# Altium schematic sheet OnboardMemoryTester.SchDoc
size C; Organization: Altium Limited; Address1: L3, 12a Rodborough Rd; Address2: Frenchs Forest; Address3: NSW; Address4: Australia 2086; DocumentNumber: 1; SheetNumber: 1; SheetTotal: 5
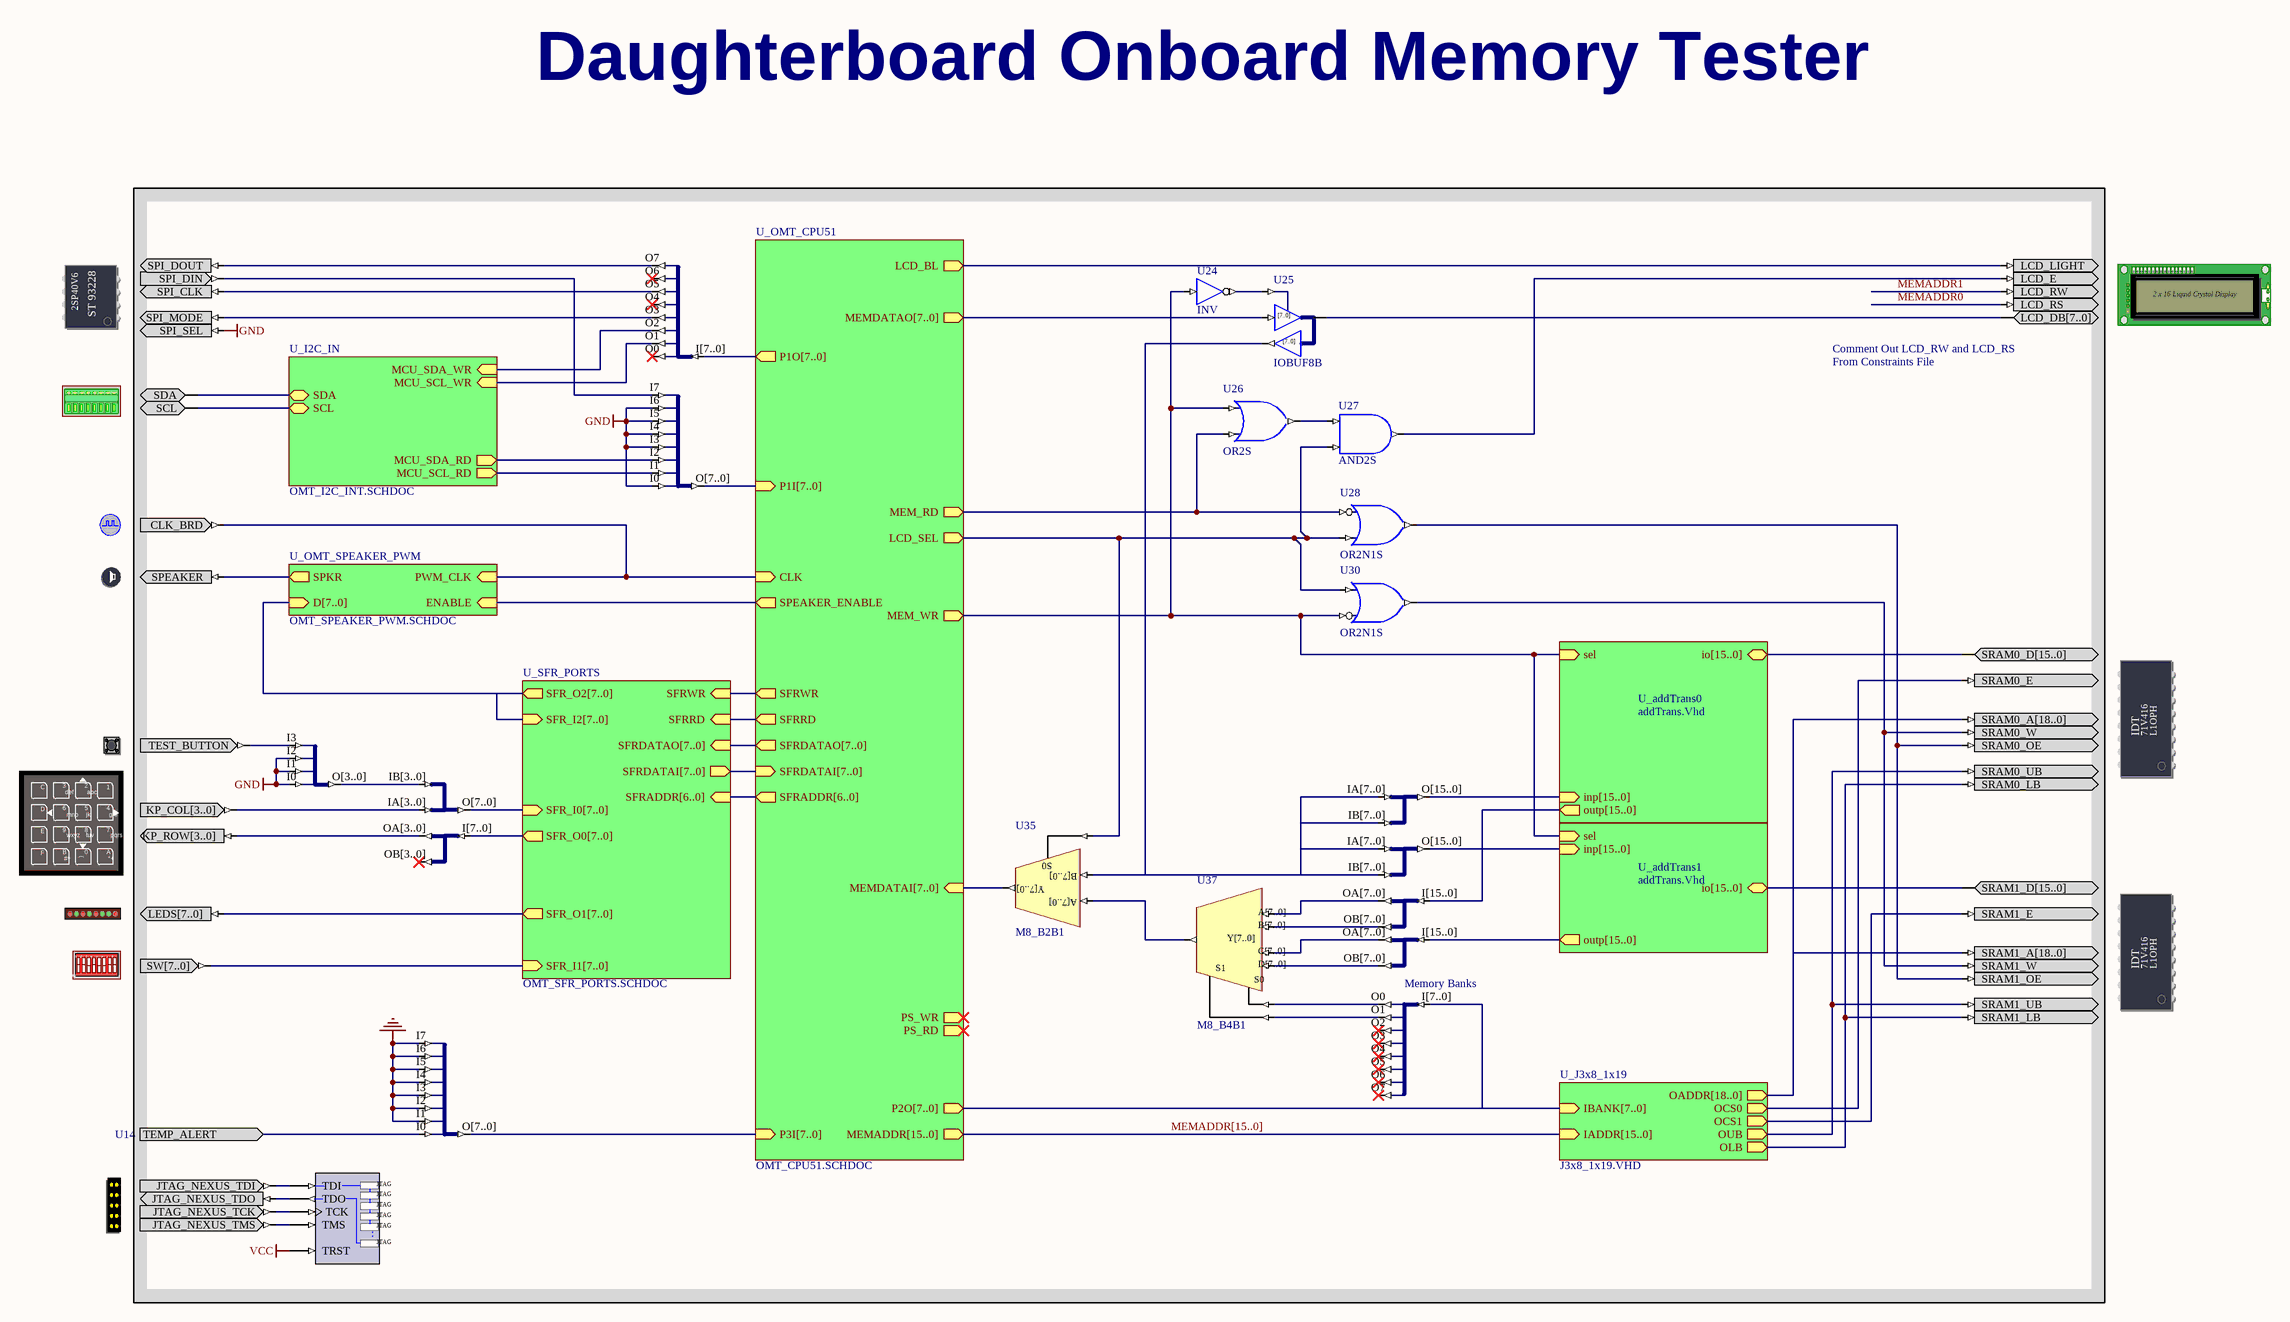
[diagram p0: OnboardMemoryTester.SchDoc]

## Parts
(Parts that share a designator on the sheet are numbered #1, #2 ... from top to bottom, then left to right.)
?#1  SERIALFMEMORY  (value not drawn)
?#2  ADCDAC_I2C  (value not drawn)
?#3  CLOCK_BOARD  (value not drawn)
?#4  SPEAKER  (value not drawn)
?#5  SRAM_DAUGHTER0  (value not drawn)
?#6  TEST_BUTTON  (value not drawn)
?#7  KEYPAD  (value not drawn)
?#8  SRAM_DAUGHTER1  (value not drawn)
?#9  LED  (value not drawn)
?#10  DIPSWITCH  (value not drawn)
?#11  NEXUS_JTAG_CONNECTOR  (value not drawn)
LCD  LCD  (value not drawn)
NEXUS_JTAG_PORT  NEXUS_JTAG_PORT  (value not drawn)
U23  J8B_8S  (value not drawn)
U24  INV
U25  IOBUF8B
U26  OR2S
U27  AND2S
U28  OR2N1S
U29  J8S_8B  (value not drawn)
U30  OR2N1S
U31  J4S_4B  (value not drawn)
U32  J4B2_8B  (value not drawn)
U33  J8B2_16B  (value not drawn)
U34  J8B_4B2  (value not drawn)
U35  M8_B2B1
U36  J8B2_16B  (value not drawn)
U37  M8_B4B1
U38  J16B_8B2  (value not drawn)
U39  J16B_8B2  (value not drawn)
U40  J8B_8S  (value not drawn)
U41  J8S_8B  (value not drawn)

## Sub-sheets
U_addTrans0 = addTrans.Vhd: inp[15..0] (in), io[15..0] (bidir), outp[15..0] (out), sel (in)  | VHDLENTITY: addTrans
U_addTrans1 = addTrans.Vhd: inp[15..0] (in), io[15..0] (bidir), outp[15..0] (out), sel (in)  | VHDLENTITY: addTrans
U_I2C_IN = OMT_I2C_INT.SCHDOC: SDA (bidir), SCL (bidir), MCU_SDA_RD (out), MCU_SDA_WR (in), MCU_SCL_WR (in), MCU_SCL_RD (out)
U_J3x8_1x19 = J3x8_1x19.VHD: IADDR[15..0] (in), IBANK[7..0] (in), OADDR[18..0] (out), OCS0 (out), OCS1 (out), OLB (out), OUB (out)  | VHDLENTITY: J3x8_1x19
U_OMT_CPU51 = OMT_CPU51.SCHDOC: CLK (in), MEMADDR[15..0] (out), MEM_WR (out), MEM_RD (out), SFRDATAO[7..0] (out), SFRDATAI[7..0] (in), SFRWR (out), SFRRD (out), SFRADDR[6..0] (out), LCD_BL (out), SPEAKER_ENABLE (out), P1O[7..0] (out), P1I[7..0] (in), MEMDATAO[7..0] (out), MEMDATAI[7..0] (in), PS_WR (out), PS_RD (out), P2O[7..0] (out), LCD_SEL (out), P3I[7..0] (in)
U_OMT_SPEAKER_PWM = OMT_SPEAKER_PWM.SCHDOC: ENABLE (in), PWM_CLK (in), D[7..0] (in), SPKR (out)
U_SFR_PORTS = OMT_SFR_PORTS.SCHDOC: SFRDATAO[7..0] (in), SFRWR (in), SFRDATAI[7..0] (out), SFRRD (in), SFRADDR[6..0] (in), SFR_I0[7..0] (in), SFR_O0[7..0] (out), SFR_I1[7..0] (in), SFR_O1[7..0] (out), SFR_I2[7..0] (in), SFR_O2[7..0] (out)

## Ports
TEMP_ALERT (in, see U14)

## Nets
GND: ?#1.SPI_SEL U29.I0 U29.I3 U29.I4 U29.I5 U29.I6 U31.I0 U31.I1 U31.I2 U41.I1 U41.I2 U41.I3 U41.I4 U41.I5 U41.I6 U41.I7
VCC: NEXUS_JTAG_PORT.TRST
MEMADDR0: LCD.LCD_RS
MEMADDR1: LCD.LCD_RW
TEMP_ALERT: U41.I0 ; port TEMP_ALERT
Net?#1_SPI_CLK: ?#1.SPI_CLK U23.O5
Net?#1_SPI_DIN: ?#1.SPI_DIN U29.I7
Net?#1_SPI_DOUT: ?#1.SPI_DOUT U23.O7
Net?#1_SPI_MODE: ?#1.SPI_MODE U23.O3
Net?#2_SCL: ?#2.SCL ; sheet U_I2C_IN/SCL
Net?#2_SDA: ?#2.SDA ; sheet U_I2C_IN/SDA
Net?#3_CLK_BRD: ?#3.CLK_BRD ; sheet U_OMT_SPEAKER_PWM/PWM_CLK, sheet U_OMT_CPU51/CLK
Net?#4_SPEAKER: ?#4.SPEAKER ; sheet U_OMT_SPEAKER_PWM/SPKR
Net?#5_SRAM0_A[18..0]: ?#5.SRAM0_A[18..0] ?#8.SRAM1_A[18..0] ; sheet U_J3x8_1x19/OADDR[18..0]
Net?#5_SRAM0_D[15..0]: ?#5.SRAM0_D[15..0] ; sheet U_addTrans0/io[15..0]
Net?#5_SRAM0_E: ?#5.SRAM0_E ; sheet U_J3x8_1x19/OCS0
Net?#5_SRAM0_LB: ?#5.SRAM0_LB ?#8.SRAM1_LB ; sheet U_J3x8_1x19/OLB
Net?#5_SRAM0_OE: ?#5.SRAM0_OE ?#8.SRAM1_OE U28.O
Net?#5_SRAM0_UB: ?#5.SRAM0_UB ?#8.SRAM1_UB ; sheet U_J3x8_1x19/OUB
Net?#5_SRAM0_W: ?#5.SRAM0_W ?#8.SRAM1_W U30.O
Net?#6_TEST_BUTTON: ?#6.TEST_BUTTON U31.I3
Net?#7_KP_COL[3..0]: ?#7.KP_COL[3..0] U32.IA[3..0]
Net?#7_KP_ROW[3..0]: ?#7.KP_ROW[3..0] U34.OA[3..0]
Net?#8_SRAM1_D[15..0]: ?#8.SRAM1_D[15..0] ; sheet U_addTrans1/io[15..0]
Net?#8_SRAM1_E: ?#8.SRAM1_E ; sheet U_J3x8_1x19/OCS1
Net?#9_LEDS[7..0]: ?#9.LEDS[7..0] ; sheet U_SFR_PORTS/SFR_O1[7..0]
Net?#10_SW[7..0]: ?#10.SW[7..0] ; sheet U_SFR_PORTS/SFR_I1[7..0]
Net?#11_JTAG_NEXUS_TCK: ?#11.JTAG_NEXUS_TCK NEXUS_JTAG_PORT.TCK
Net?#11_JTAG_NEXUS_TDI: ?#11.JTAG_NEXUS_TDI NEXUS_JTAG_PORT.TDI
Net?#11_JTAG_NEXUS_TDO: ?#11.JTAG_NEXUS_TDO NEXUS_JTAG_PORT.TDO
Net?#11_JTAG_NEXUS_TMS: ?#11.JTAG_NEXUS_TMS NEXUS_JTAG_PORT.TMS
NetLCD_LCD_DB[7..0]: LCD.LCD_DB[7..0] U25.IO[7..0]
NetLCD_LCD_E: LCD.LCD_E U27.O
NetLCD_LCD_LIGHT: LCD.LCD_LIGHT ; sheet U_OMT_CPU51/LCD_BL
NetU23_I[7..0]: U23.I[7..0] ; sheet U_OMT_CPU51/P1O[7..0]
NetU23_O1: U23.O1 ; sheet U_I2C_IN/MCU_SCL_WR
NetU23_O2: U23.O2 ; sheet U_I2C_IN/MCU_SDA_WR
NetU24_I: U24.I U26.I0 U30.I0 ; sheet U_OMT_CPU51/MEM_WR, sheet U_addTrans1/sel, sheet U_addTrans0/sel
NetU24_O: U24.O U25.T
NetU25_I[7..0]: U25.I[7..0] ; sheet U_OMT_CPU51/MEMDATAO[7..0]
NetU25_O[7..0]: U25.O[7..0] U33.IA[7..0] U33.IB[7..0] U35.B[7..0] U36.IA[7..0] U36.IB[7..0]
NetU26_I1: U26.I1 U28.I0 ; sheet U_OMT_CPU51/MEM_RD
NetU26_O: U26.O U27.I0
NetU27_I1: U27.I1 U28.I1 U30.I1 U35.S0 ; sheet U_OMT_CPU51/LCD_SEL
NetU29_I1: U29.I1 ; sheet U_I2C_IN/MCU_SCL_RD
NetU29_I2: U29.I2 ; sheet U_I2C_IN/MCU_SDA_RD
NetU29_O[7..0]: U29.O[7..0] ; sheet U_OMT_CPU51/P1I[7..0]
NetU31_O[3..0]: U31.O[3..0] U32.IB[3..0]
NetU32_O[7..0]: U32.O[7..0] ; sheet U_SFR_PORTS/SFR_I0[7..0]
NetU33_O[15..0]: U33.O[15..0] ; sheet U_addTrans0/inp[15..0]
NetU34_I[7..0]: U34.I[7..0] ; sheet U_SFR_PORTS/SFR_O0[7..0]
NetU35_A[7..0]: U35.A[7..0] U37.Y[7..0]
NetU35_Y[7..0]: U35.Y[7..0] ; sheet U_OMT_CPU51/MEMDATAI[7..0]
NetU36_O[15..0]: U36.O[15..0] ; sheet U_addTrans1/inp[15..0]
NetU37_A[7..0]: U37.A[7..0] U38.OA[7..0]
NetU37_B[7..0]: U37.B[7..0] U38.OB[7..0]
NetU37_C[7..0]: U37.C[7..0] U39.OA[7..0]
NetU37_D[7..0]: U37.D[7..0] U39.OB[7..0]
NetU37_S0: U37.S0 U40.O0
NetU37_S1: U37.S1 U40.O1
NetU38_I[15..0]: U38.I[15..0] ; sheet U_addTrans0/outp[15..0]
NetU39_I[15..0]: U39.I[15..0] ; sheet U_addTrans1/outp[15..0]
NetU40_I[7..0]: U40.I[7..0] ; sheet U_OMT_CPU51/P2O[7..0], sheet U_J3x8_1x19/IBANK[7..0]
NetU41_O[7..0]: U41.O[7..0] ; sheet U_OMT_CPU51/P3I[7..0]
(unnamed): sheet U_OMT_SPEAKER_PWM/ENABLE, sheet U_OMT_CPU51/SPEAKER_ENABLE
(unnamed): sheet U_SFR_PORTS/SFRWR, sheet U_OMT_CPU51/SFRWR
(unnamed): sheet U_SFR_PORTS/SFRRD, sheet U_OMT_CPU51/SFRRD

Not connected (* = marked no-connect by the designer): U23 O0* O4* O6*; U34 OB[3..0]*; U40 O2* O3* O4* O5* O6* O7*

## Buses and harness runs
bus MEMADDR[15..0] = sheet U_J3x8_1x19/IADDR[15..0] = sheet U_OMT_CPU51/MEMADDR[15..0]
bus sheet U_J3x8_1x19/IBANK[7..0] = sheet U_OMT_CPU51/P2O[7..0]
bus sheet U_OMT_CPU51/SFRADDR[6..0] = sheet U_SFR_PORTS/SFRADDR[6..0]
bus sheet U_OMT_CPU51/SFRDATAI[7..0] = sheet U_SFR_PORTS/SFRDATAI[7..0]
bus sheet U_OMT_CPU51/SFRDATAO[7..0] = sheet U_SFR_PORTS/SFRDATAO[7..0]
bus sheet U_OMT_SPEAKER_PWM/D[7..0] = sheet U_SFR_PORTS/SFR_I2[7..0] = sheet U_SFR_PORTS/SFR_O2[7..0]

## Notes on the sheet
- Daughterboard Onboard Memory Tester
- (near LCD) Comment Out LCD_RW and LCD_RS
- From Constraints File
- Memory Banks
- Title
- Size:
- Date:
- File:
- C
- Number:
- Time:
- Revision:
- Sheet
- of
- (in symbol DIPSWITCH) 1; 2; 3; 4; 5; 6; 7; 8; ON
- (in symbol IOBUF8B) [7..0]
- (in symbol KEYPAD) C; 3; 2; 1; def; abc; 6; 5; 4; D; mno; jkl; ghi; E; 9; 8; 7; wxyz; tuv; pqrs; F; B; 0; A; #^; (; *+
- (in symbol LCD) 2 x 16 Liquid Crystal Display
- (in symbol NEXUS_JTAG_PORT) JTAG; .
- (in symbol SERIALFMEMORY) 2SP40V6; ST 93228
- (in symbol SRAM_DAUGHTER0) IDT; 71V416; L1OPH
- (in symbol SRAM_DAUGHTER1) IDT; 71V416; L1OPH

## Library data of the parts
?#1 = SERIALFMEMORY: Serial Flash Memory; PortComponent: True; Published: 19-Nov-2003; Publisher: Altium Limited
?#2 = ADCDAC_I2C: Analog Digital/ Digital Analog Converter, I2C Interface; PortComponent: True; Published: 19-Nov-2003; Publisher: Altium Limited
?#3 = CLOCK_BOARD: Global System Clock Supply; PortComponent: True; Published: 19-Nov-2003; Publisher: Altium Limited
?#4 = SPEAKER: Sound interface; PortComponent: True; Published: 19-Nov-2003; Publisher: Altium Limited
?#5 = SRAM_DAUGHTER0: SRAM - 0 Module - Daughterboard; PortComponent: True; Published: 13-May-2004; Publisher: Altium Limited
?#6 = TEST_BUTTON: Test Button; PortComponent: True; Published: 19-Nov-2003; Publisher: Altium Limited
?#7 = KEYPAD: Key Pad; PortComponent: True; Published: 19-Nov-2003; Publisher: Altium Limited
?#8 = SRAM_DAUGHTER1: SRAM - 1 Module - Daughterboard; PortComponent: True; Published: 13-May-2004; Publisher: Altium Limited
?#9 = LED: 8-Way LEDS; PortComponent: True; Published: 19-Nov-2003; Publisher: Altium Limited
?#10 = DIPSWITCH: 8-Way Dip Switch; PortComponent: True; Published: 19-Nov-2003; Publisher: Altium Limited
?#11 = NEXUS_JTAG_CONNECTOR: JTAG Port; PortComponent: True; Published: 19-Nov-2003; Publisher: Altium Limited
LCD = LCD: Liquid Crystal Display; PortComponent: True; Published: 19-Nov-2003; Publisher: Altium Limited
NEXUS_JTAG_PORT = NEXUS_JTAG_PORT: Soft Nexus-Chain Connector; NEXUS_JTAG_CONNECTOR: True; VHDLIB_SIM: GENERIC_LIB; Published: 29-Jan-2004; Publisher: Altium Limited
U23 U40 = J8B_8S: 8-Bit input bus to 8 single pin outputs; FunctionalClass: Bus Joiner; PortSize: 8; ArchiveName: GENERIC; VHDLIB_SIM: GENERIC_LIB; Published: 29-Jan-2004; Publisher: Altium Limited; LastRevisionNo: 1.00.00; HelpURL: CR0118 FPGA Generic Library Guide.pdf#page=303; ComponentLink1URL: CR0126 FPGA Bus Joiner Resource Usage.pdf#page=27; ComponentLink1Description: Core &Resource Usage
U24 = INV: Inverter; ArchiveName: GENERIC; VHDLIB_SIM: GENERIC_LIB; Published: 29-Jan-2004; Publisher: Altium Limited; Xilinx Equivalent: INV; Core Revision: 1.00.00
U25 = IOBUF8B: 8-Bit Input/Output Buffer, Bus Version; ArchiveName: GENERIC; VHDLIB_SIM: GENERIC_LIB; Published: 29-Jan-2004; Publisher: Altium Limited; Core Revision: 1.00.00
U26 = OR2S: 2-Input OR Gate, Single Pin Version; Xilinx Equivalent: OR2; ArchiveName: GENERIC; VHDLIB_SIM: GENERIC_LIB; Published: 29-Jan-2004; Publisher: Altium Limited; Core Revision: 1.00.00
U27 = AND2S: 2-Input AND Gate, Single Pin Version; Xilinx Equivalent: AND2; ArchiveName: GENERIC; VHDLIB_SIM: GENERIC_LIB; Published: 29-Jan-2004; Publisher: Altium Limited; Core Revision: 1.00.00
U28 U30 = OR2N1S: 2-Input OR Gate with Active Low A Input, Single Pin Version; Xilinx Equivalent: OR2B1; ArchiveName: GENERIC; VHDLIB_SIM: GENERIC_LIB; Published: 29-Jan-2004; Publisher: Altium Limited; Core Revision: 1.00.00
U29 = J8S_8B: 8 Single pin inputs to single 8-Bit output bus; FunctionalClass: Bus Joiner; PortSize: 8; ArchiveName: GENERIC; VHDLIB_SIM: GENERIC_LIB; Published: 29-Jan-2004; Publisher: Altium Limited; LastRevisionNo: 1.00.00; HelpURL: CR0118 FPGA Generic Library Guide.pdf#page=305; ComponentLink1URL: CR0126 FPGA Bus Joiner Resource Usage.pdf#page=28; ComponentLink1Description: Core &Resource Usage
U31 = J4S_4B: 4 Single pin inputs to single 4-Bit output bus; FunctionalClass: Bus Joiner; PortSize: 4; ArchiveName: GENERIC; VHDLIB_SIM: GENERIC_LIB; Published: 29-Jan-2004; Publisher: Altium Limited; LastRevisionNo: 1.00.00; HelpURL: CR0118 FPGA Generic Library Guide.pdf#page=305; ComponentLink1URL: CR0126 FPGA Bus Joiner Resource Usage.pdf#page=12; ComponentLink1Description: Core &Resource Usage
U32 = J4B2_8B: 2 x 4-Bit input bus to 1 x 8-bit output bus; FunctionalClass: Bus Joiner; PortSize: 4; ArchiveName: GENERIC; VHDLIB_SIM: GENERIC_LIB; Published: 29-Jan-2004; Publisher: Altium Limited; LastRevisionNo: 1.00.00; HelpURL: CR0118 FPGA Generic Library Guide.pdf#page=301; ComponentLink1URL: CR0126 FPGA Bus Joiner Resource Usage.pdf#page=6; ComponentLink1Description: Core &Resource Usage
U33 U36 = J8B2_16B: 2 x 8-Bit input bus to 1 x 16-bit output bus; ArchiveName: GENERIC; VHDLIB_SIM: GENERIC_LIB; Published: 29-Jan-2004; Publisher: Altium Limited; Core Revision: 1.00.00
U34 = J8B_4B2: 1 x 8-bit input bus to 2 x 4-Bit output bus; FunctionalClass: Bus Joiner; PortSize: 8; ArchiveName: GENERIC; VHDLIB_SIM: GENERIC_LIB; Published: 29-Jan-2004; Publisher: Altium Limited; LastRevisionNo: 1.00.00; HelpURL: CR0118 FPGA Generic Library Guide.pdf#page=297; ComponentLink1URL: CR0126 FPGA Bus Joiner Resource Usage.pdf#page=25; ComponentLink1Description: Core &Resource Usage
U35 = M8_B2B1: 2x8-Bit Bus to 1x8-Bit Bus Multiplexer; ArchiveName: GENERIC; VHDLIB_SIM: GENERIC_LIB; Published: 29-Jan-2004; Publisher: Altium Limited; Core Revision: 1.00.00
U37 = M8_B4B1: 4x8-Bit Bus to 1x8-Bit Bus Multiplexer; ArchiveName: GENERIC; VHDLIB_SIM: GENERIC_LIB; Published: 29-Jan-2004; Publisher: Altium Limited; Core Revision: 1.00.00
U38 U39 = J16B_8B2: 1 x 16-bit input bus to 2 x 8-Bit output bus; ArchiveName: GENERIC; VHDLIB_SIM: GENERIC_LIB; Published: 29-Jan-2004; Publisher: Altium Limited; Core Revision: 1.00.00
U41 = J8S_8B: 8 Single pin inputs to single 8-Bit output bus; ArchiveName: GENERIC; VHDLIB_SIM: GENERIC_LIB; Published: 29-Jan-2004; Publisher: Altium Limited; Core Revision: 1.00.00